# Altium schematic sheet LightLink_V4.SchDoc
size C; SheetNumber: 1; SheetTotal: 6
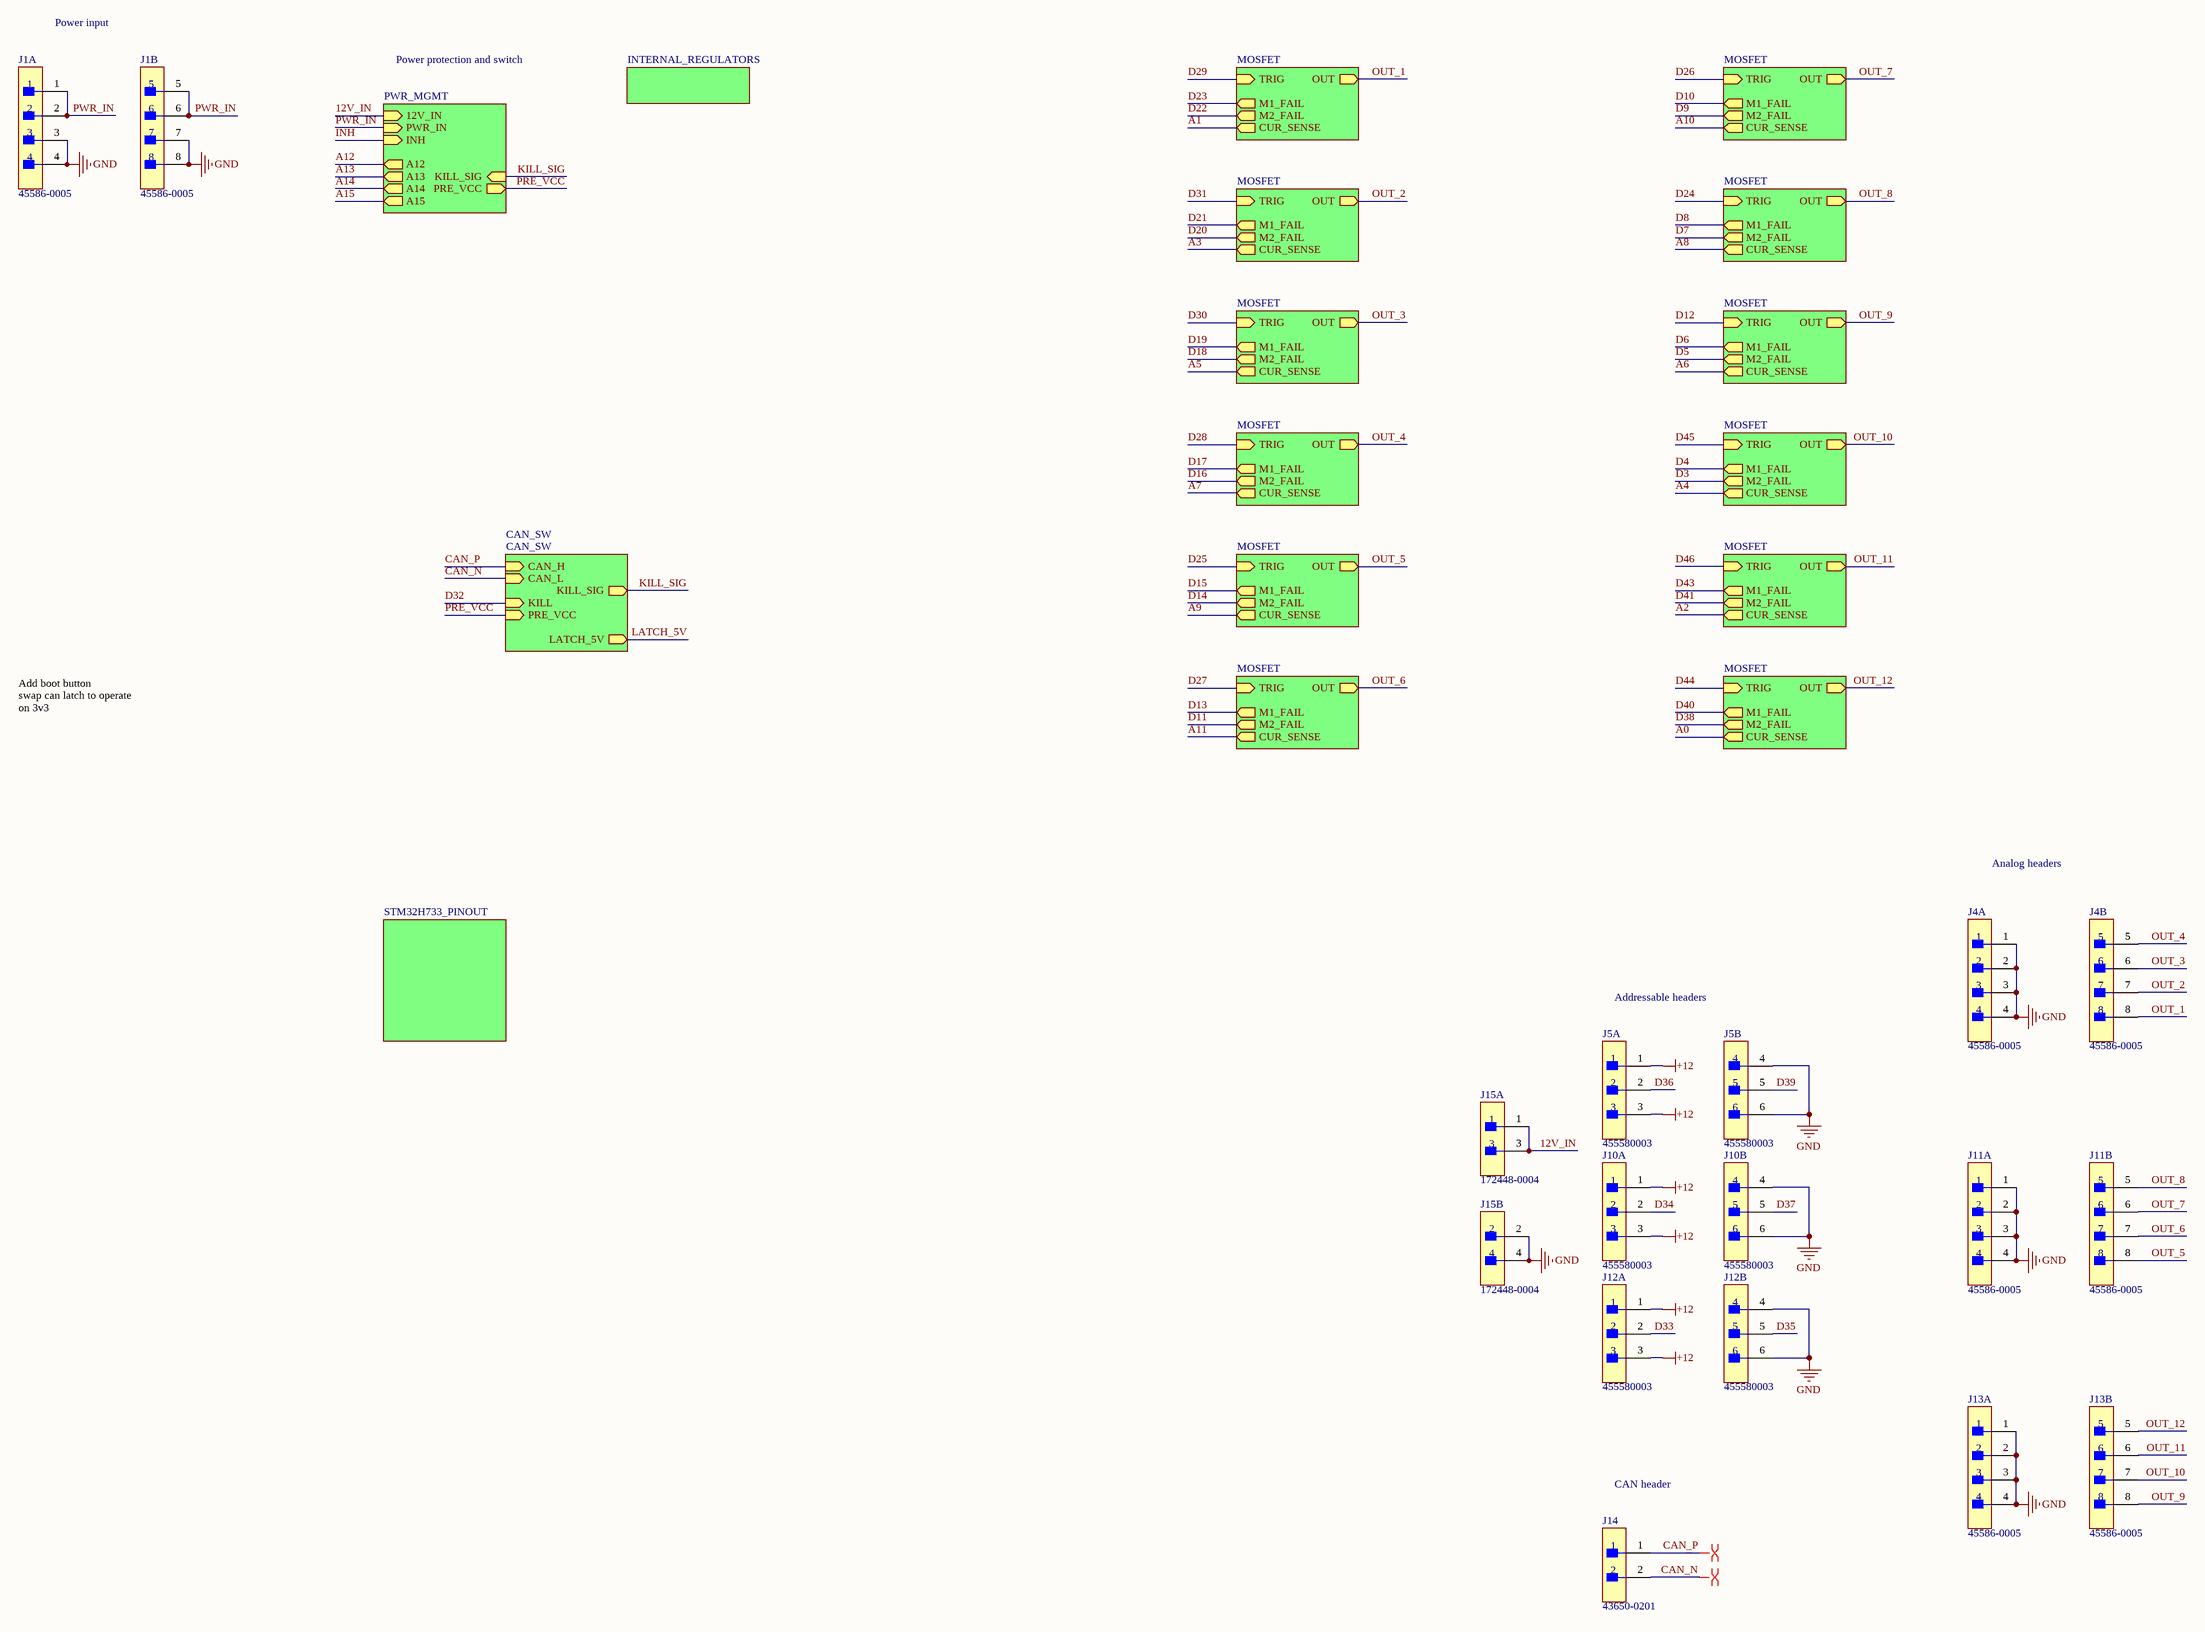
[diagram p0: LightLink_V4.SchDoc]

## Parts
J1  45586-0005  [FP-45586-0005-MFG]  (parts A,B of 2)
J4  45586-0005  [FP-45586-0005-MFG]  (parts A,B of 2)
J5  455580003  [FP-455580003-MFG]  (parts A,B of 2)
J10  455580003  [FP-455580003-MFG]  (parts A,B of 2)
J11  45586-0005  [FP-45586-0005-MFG]  (parts A,B of 2)
J12  455580003  [FP-455580003-MFG]  (parts A,B of 2)
J13  45586-0005  [FP-45586-0005-MFG]  (parts A,B of 2)
J14  43650-0201  [FP-43650-0201-MFG]
J15  172448-0004  [FP-39-30-1041-MFG]  (parts A,B of 2)

## Sub-sheets
CAN_SW = CAN_SW: CAN_H (in), CAN_L (in), KILL (in), KILL_SIG (out), PRE_VCC (in), LATCH_5V (out)
INTERNAL_REGULATORS = INTERNAL_REGULATORS: no entries
M = MOSFET: TRIG (in), OUT (out), M2_FAIL (out), M1_FAIL (out), CUR_SENSE (out)
M = MOSFET: TRIG (in), OUT (out), M2_FAIL (out), M1_FAIL (out), CUR_SENSE (out)
M = MOSFET: TRIG (in), OUT (out), M2_FAIL (out), M1_FAIL (out), CUR_SENSE (out)
M = MOSFET: TRIG (in), OUT (out), M2_FAIL (out), M1_FAIL (out), CUR_SENSE (out)
M = MOSFET: TRIG (in), OUT (out), M2_FAIL (out), M1_FAIL (out), CUR_SENSE (out)
M = MOSFET: TRIG (in), OUT (out), M2_FAIL (out), M1_FAIL (out), CUR_SENSE (out)
M = MOSFET: TRIG (in), OUT (out), M2_FAIL (out), M1_FAIL (out), CUR_SENSE (out)
M = MOSFET: TRIG (in), OUT (out), M2_FAIL (out), M1_FAIL (out), CUR_SENSE (out)
M = MOSFET: TRIG (in), OUT (out), M2_FAIL (out), M1_FAIL (out), CUR_SENSE (out)
M = MOSFET: TRIG (in), OUT (out), M2_FAIL (out), M1_FAIL (out), CUR_SENSE (out)
M = MOSFET: TRIG (in), OUT (out), M2_FAIL (out), M1_FAIL (out), CUR_SENSE (out)
M = MOSFET: TRIG (in), OUT (out), M2_FAIL (out), M1_FAIL (out), CUR_SENSE (out)
PWR_MGMT = PWR_MGMT: PWR_IN (in), INH (in), A13 (out), A12 (out), PRE_VCC (out), KILL_SIG (in), A14 (out), A15 (out), 12V_IN (in)
STM32H733_PINOUT = STM32H733_PINOUT: no entries

## Nets
+12: J5.1 J5.3 J10.1 J10.3 J12.1 J12.3
GND: J1.3 J1.4 J1.7 J1.8 J4.1 J4.2 J4.3 J4.4 J5.4 J5.6 J10.4 J10.6 J11.1 J11.2 J11.3 J11.4 J12.4 J12.6 J13.1 J13.2 J13.3 J13.4 J15.2 J15.4
12V_IN: J15.1 J15.3 ; sheet PWR_MGMT/12V_IN
A0: sheet M/CUR_SENSE
A1: sheet M/CUR_SENSE
A2: sheet M/CUR_SENSE
A3: sheet M/CUR_SENSE
A4: sheet M/CUR_SENSE
A5: sheet M/CUR_SENSE
A6: sheet M/CUR_SENSE
A7: sheet M/CUR_SENSE
A8: sheet M/CUR_SENSE
A9: sheet M/CUR_SENSE
A10: sheet M/CUR_SENSE
A11: sheet M/CUR_SENSE
A12: sheet PWR_MGMT/A12
A13: sheet PWR_MGMT/A13
A14: sheet PWR_MGMT/A14
A15: sheet PWR_MGMT/A15
CAN_N: J14.2 ; sheet CAN_SW/CAN_L
CAN_P: J14.1 ; sheet CAN_SW/CAN_H
D3: sheet M/M2_FAIL
D4: sheet M/M1_FAIL
D5: sheet M/M2_FAIL
D6: sheet M/M1_FAIL
D7: sheet M/M2_FAIL
D8: sheet M/M1_FAIL
D9: sheet M/M2_FAIL
D10: sheet M/M1_FAIL
D11: sheet M/M2_FAIL
D12: sheet M/TRIG
D13: sheet M/M1_FAIL
D14: sheet M/M2_FAIL
D15: sheet M/M1_FAIL
D16: sheet M/M2_FAIL
D17: sheet M/M1_FAIL
D18: sheet M/M2_FAIL
D19: sheet M/M1_FAIL
D20: sheet M/M2_FAIL
D21: sheet M/M1_FAIL
D22: sheet M/M2_FAIL
D23: sheet M/M1_FAIL
D24: sheet M/TRIG
D25: sheet M/TRIG
D26: sheet M/TRIG
D27: sheet M/TRIG
D28: sheet M/TRIG
D29: sheet M/TRIG
D30: sheet M/TRIG
D31: sheet M/TRIG
D32: sheet CAN_SW/KILL
D33: J12.2
D34: J10.2
D35: J12.5
D36: J5.2
D37: J10.5
D38: sheet M/M2_FAIL
D39: J5.5
D40: sheet M/M1_FAIL
D41: sheet M/M2_FAIL
D43: sheet M/M1_FAIL
D44: sheet M/TRIG
D45: sheet M/TRIG
D46: sheet M/TRIG
INH: sheet PWR_MGMT/INH
KILL_SIG: sheet PWR_MGMT/KILL_SIG, sheet CAN_SW/KILL_SIG
LATCH_5V: sheet CAN_SW/LATCH_5V
OUT_1: J4.8 ; sheet M/OUT
OUT_2: J4.7 ; sheet M/OUT
OUT_3: J4.6 ; sheet M/OUT
OUT_4: J4.5 ; sheet M/OUT
OUT_5: J11.8 ; sheet M/OUT
OUT_6: J11.7 ; sheet M/OUT
OUT_7: J11.6 ; sheet M/OUT
OUT_8: J11.5 ; sheet M/OUT
OUT_9: J13.8 ; sheet M/OUT
OUT_10: J13.7 ; sheet M/OUT
OUT_11: J13.6 ; sheet M/OUT
OUT_12: J13.5 ; sheet M/OUT
PRE_VCC: sheet PWR_MGMT/PRE_VCC, sheet CAN_SW/PRE_VCC
PWR_IN: J1.1 J1.2 J1.5 J1.6 ; sheet PWR_MGMT/PWR_IN

## Layout directives
differential pair: CAN_N, CAN_P

## Notes on the sheet
- Power input
- Power protection and switch
- Add boot button
  swap can latch to operate on 3v3
- Analog headers
- Addressable headers
- CAN header

## Library data of the parts
J1 J4 J11 J13 = CMP-04776-000690-1: CONN HEADER R/A 8POS 4.2MM
J5 J10 J12 = CMP-04776-000024-1: CONN HEADER R/A 6POS 4.2MM; Manufacturer: Molex; Standoff Height: 0.4mm; Conn Orientation: Right Angle; Number Of Contacts: 6; Conn Gender: Male; Voltage Rating: 600V; Current Rating: 8A; Footprint Url: https://www.molex.com/pdm_docs/sd/455580003_sd.pdf; Number Of Rows: 2; Lead Free: Yes; Digikey Description: CONN HEADER R/A 6POS 4.2MM; ComponentLink2URL: https://www.molex.com/webdocs/datasheets/pdf/en-us/0455580003_PCB_HEADERS.pdf; Octopart: https://octopart.com/45558-0003-molex-7672845; Package: 0; Device Class L3: unset; ComponentLink2Description: Datasheet; Device Class L2: Headers and Wire Housings; Category: Conn; Contact Material: Tin,Nickel; Mouser Description: Conn Power HDR 6 POS 4.2mm Solder ST Thru-Hole 6 Terminal 1 Port Mini-Fit Jr™ Tray; Manufacturer Part Number: 455580003; Pitch: 4.2mm; Device Class L1: Connectors; Temperature Range Low: -40°C; Temperature: -40°C to +105°C; RoHS: TRUE; Temperature Range High: +105°C; Height: 10.38mm; Automotive: No
J14 = CMP-04776-000557-1: CONN HEADER R/A 2POS 3MM; Voltage Rating: 600V; Number of Circuits: 2; Insulation Resistance: 1GR; Current Rating: 5A; Voltage Rating (DC): 250V; Contact Resistance: 10mR; Gender: Male; Number of Ports: 1; Glow Wire Compliant: Compliant; Pitch: 3mm; Contact Plating: Gold; Series: 43650; Color: Black; Max Operating Temperature: 105°C; Radiation Hardening: No; Orientation: Right Angle; Number of Terminals/Pins: 2; Length: 9.65mm; Case/Package: 0201; Halogen Free: Low Halogen; Housing Color: Black; Min Operating Temperature: -40°C; Package Quantity: 3927; Contact Material: Brass; Number of Rows: 1; Number of Positions: 2; Termination: Solder; Depth: 9.9mm; Mount: Through Hole; Packaging: Tray; Number of Contacts: 2; Housing Material: Thermoplastic; Flammability Rating: UL94 V-0
J15 = CMP-04776-000047-1: Different component but holes should line up. Original P/N is 39-30-1041; Manufacturer: Molex; Old_Part_Number: 5569-04A2G; Keying_to_Mating_Part: None; Circuits_maximum: 4; First_Mate__Last_Break: No; Lead_freeProcess_Capability: WAVE; Duration_at_Max_Process_Temperature_seconds: 005; Sales_Drawing: SDA-5569-NA2*-*; Current Rating: 13A; Material___Plating_Mating: Gold; Conn Gender: Male; Test_Summary: TS-5556-002; Color___Resin: Natural; Termination_Interface_Style: Through Hole; Pitch___Termination_Interface: 4.20mm; UL: E29179; PCB_Retention: Yes; Product_Name: Mini-Fit Jr.TM; Material___Resin: Nylon; Overview: Mini-Fit Jr. Power Connectors; CSA: LR19980; Plating_min___Termination: 2.540μm; Packaging_Type: Bag; Number_of_Rows: 2; Durability_mating_cycles_max: 30; Max_Cycles_at_Max_Process_Temperature: 001; Product_Specification: PS-45750-001, PS-5556-001; Net_Weight: 1.529/g; Voltage___Maximum: 600V; Material___Metal: Brass; Pitch: 4.2mm; Packaging_Specification: PK-5569-002; Shrouded: Fully; Plating_min___Mating: 0.762μm; Temperature_Range___Operating: -40°C to +105°C; Current___Maximum_per_Contact: 13.0A; Comments: Current = 13A max. per circuit when header is mated to a receptacle loaded with  45750  Mini-Fit® Plus HCS Crimp Terminal Crimped to 16 AWG wire.,  See Molex Product specification PS-5556-001 for additional current de-rating information.; Process_Temperature_max_C: 240; PCB_Thickness___Recommended: 1.78mm; Standoff Height: 0.016inch; Surface_Mount_Compatible_SMC: No; UPC: 800753579651; Conn Orientation: Right Angle; Material___Plating_Termination: Matte Tin; ComponentLink2Description: Datasheet; Footprint Url: https://www.molex.com/pdm_docs/sd/039301041_sd.pdf; Contact Material: Gold,Nickel; Octopart: https://octopart.com/39-30-1041-molex-276737; Digikey Description: CONN HEADER R/A 4POS 4.2MM; imported: yes; Series: 5569; Mouser Description: Headers & Wire Housings 4 CKT R/A HEADER; Temperature Range High: +105°C; Category: Conn; Polarized_to_Mating_Part: Yes; Pitch___Mating_Interface: 4.20mm; Automotive: No; Guide_to_Mating_Part: No; Lock_to_Mating_Part: Yes; Number Of Contacts: 4; Temperature Range Low: -40°C; RoHS: TRUE; Status: Active; imported_from: 3D Model; ComponentLink2URL: http://www.molex.com/pdm_docs/sd/039301041_sd.pdf; part_page: http://www.molex.com/molex/products/datasheet.jsp?part=active/0039301041_PCB_HEADERS.xml; Temperature: -40°C to +105°C; Device Class L3: unset; Device Class L1: Connectors; Package: 39-30-1041; Circuits_Loaded: 4; Lead Free: Yes; Ipc Land Pattern Name: CAPAD1016W80L630D240; Application: Power, Wire-to-Board; Voltage Rating: 600V; Manufacturer Part Number: 39-30-1041; Breakaway: No; Orientation: Right Angle; Flammability: 94V-2; 3D_model: http://www.molex.com/pdm_docs/stp/39-30-1041_stp.zip; Number Of Rows: 2; Polarized_to_PCB: Yes; Device Class L2: Headers and Wire Housings; Glow_Wire_Compliant: No; Stackable: No; PCB_Locator: Yes